# EAGLE design Transceiver Module Dev Board（without MCU）_V0.1 (EAGLE 9.6.2)
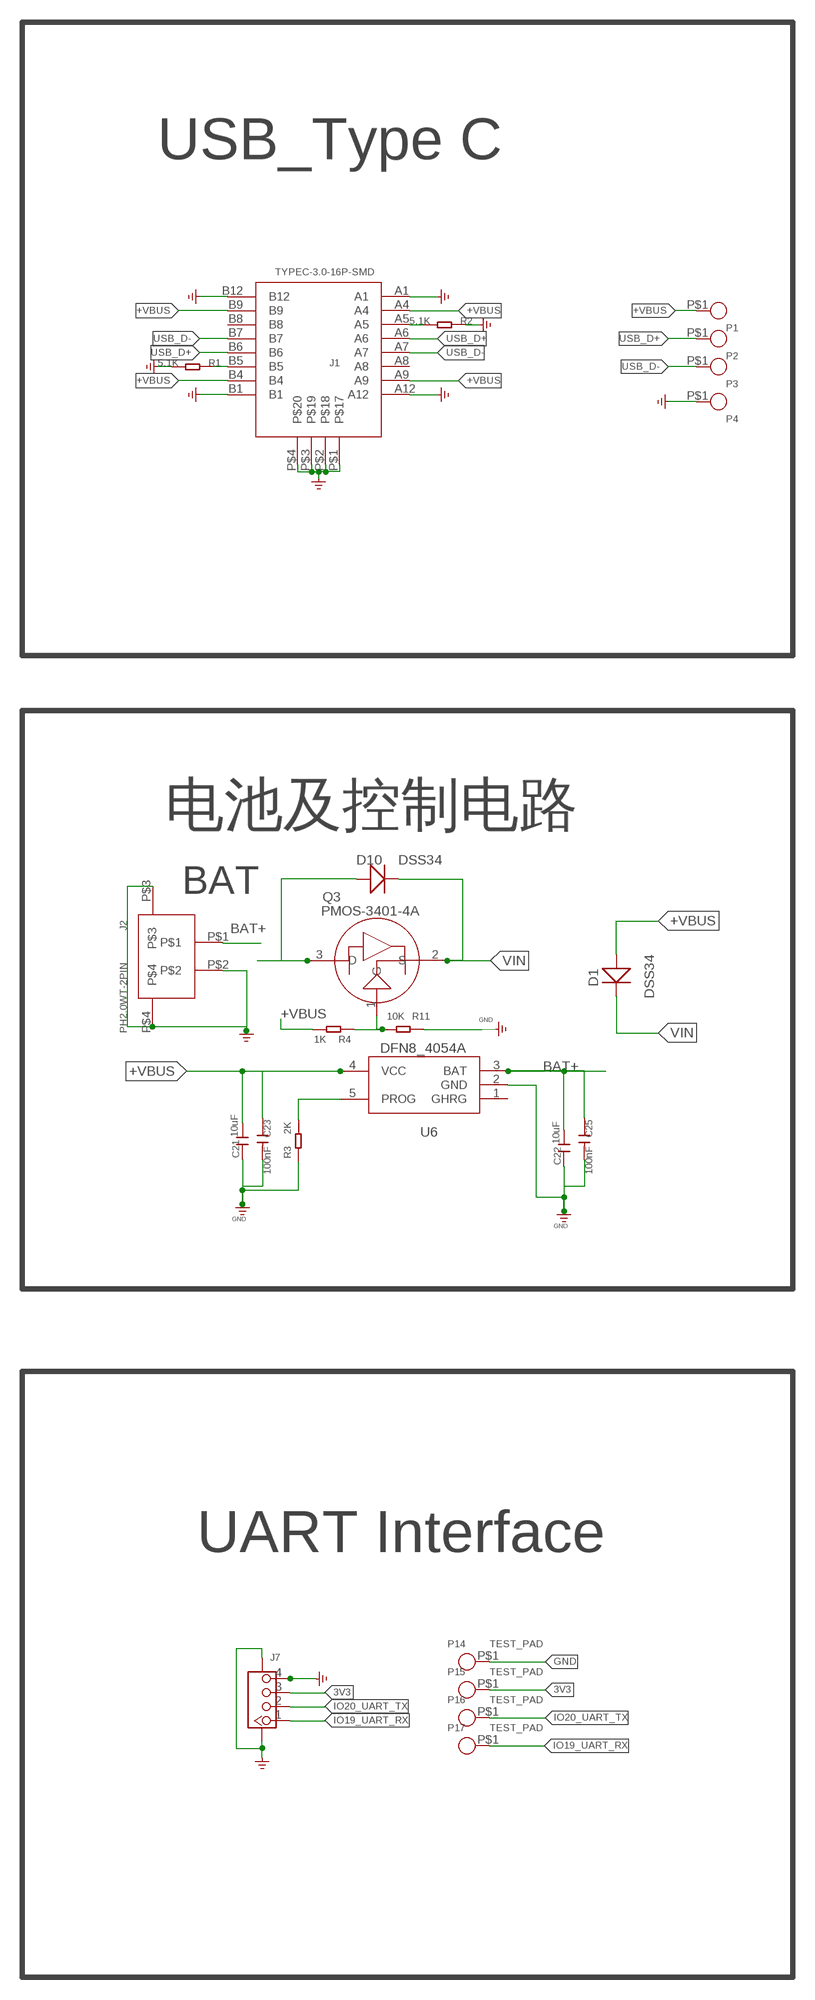
[diagram p0: schematic, sheet 1, part 1 of 2]
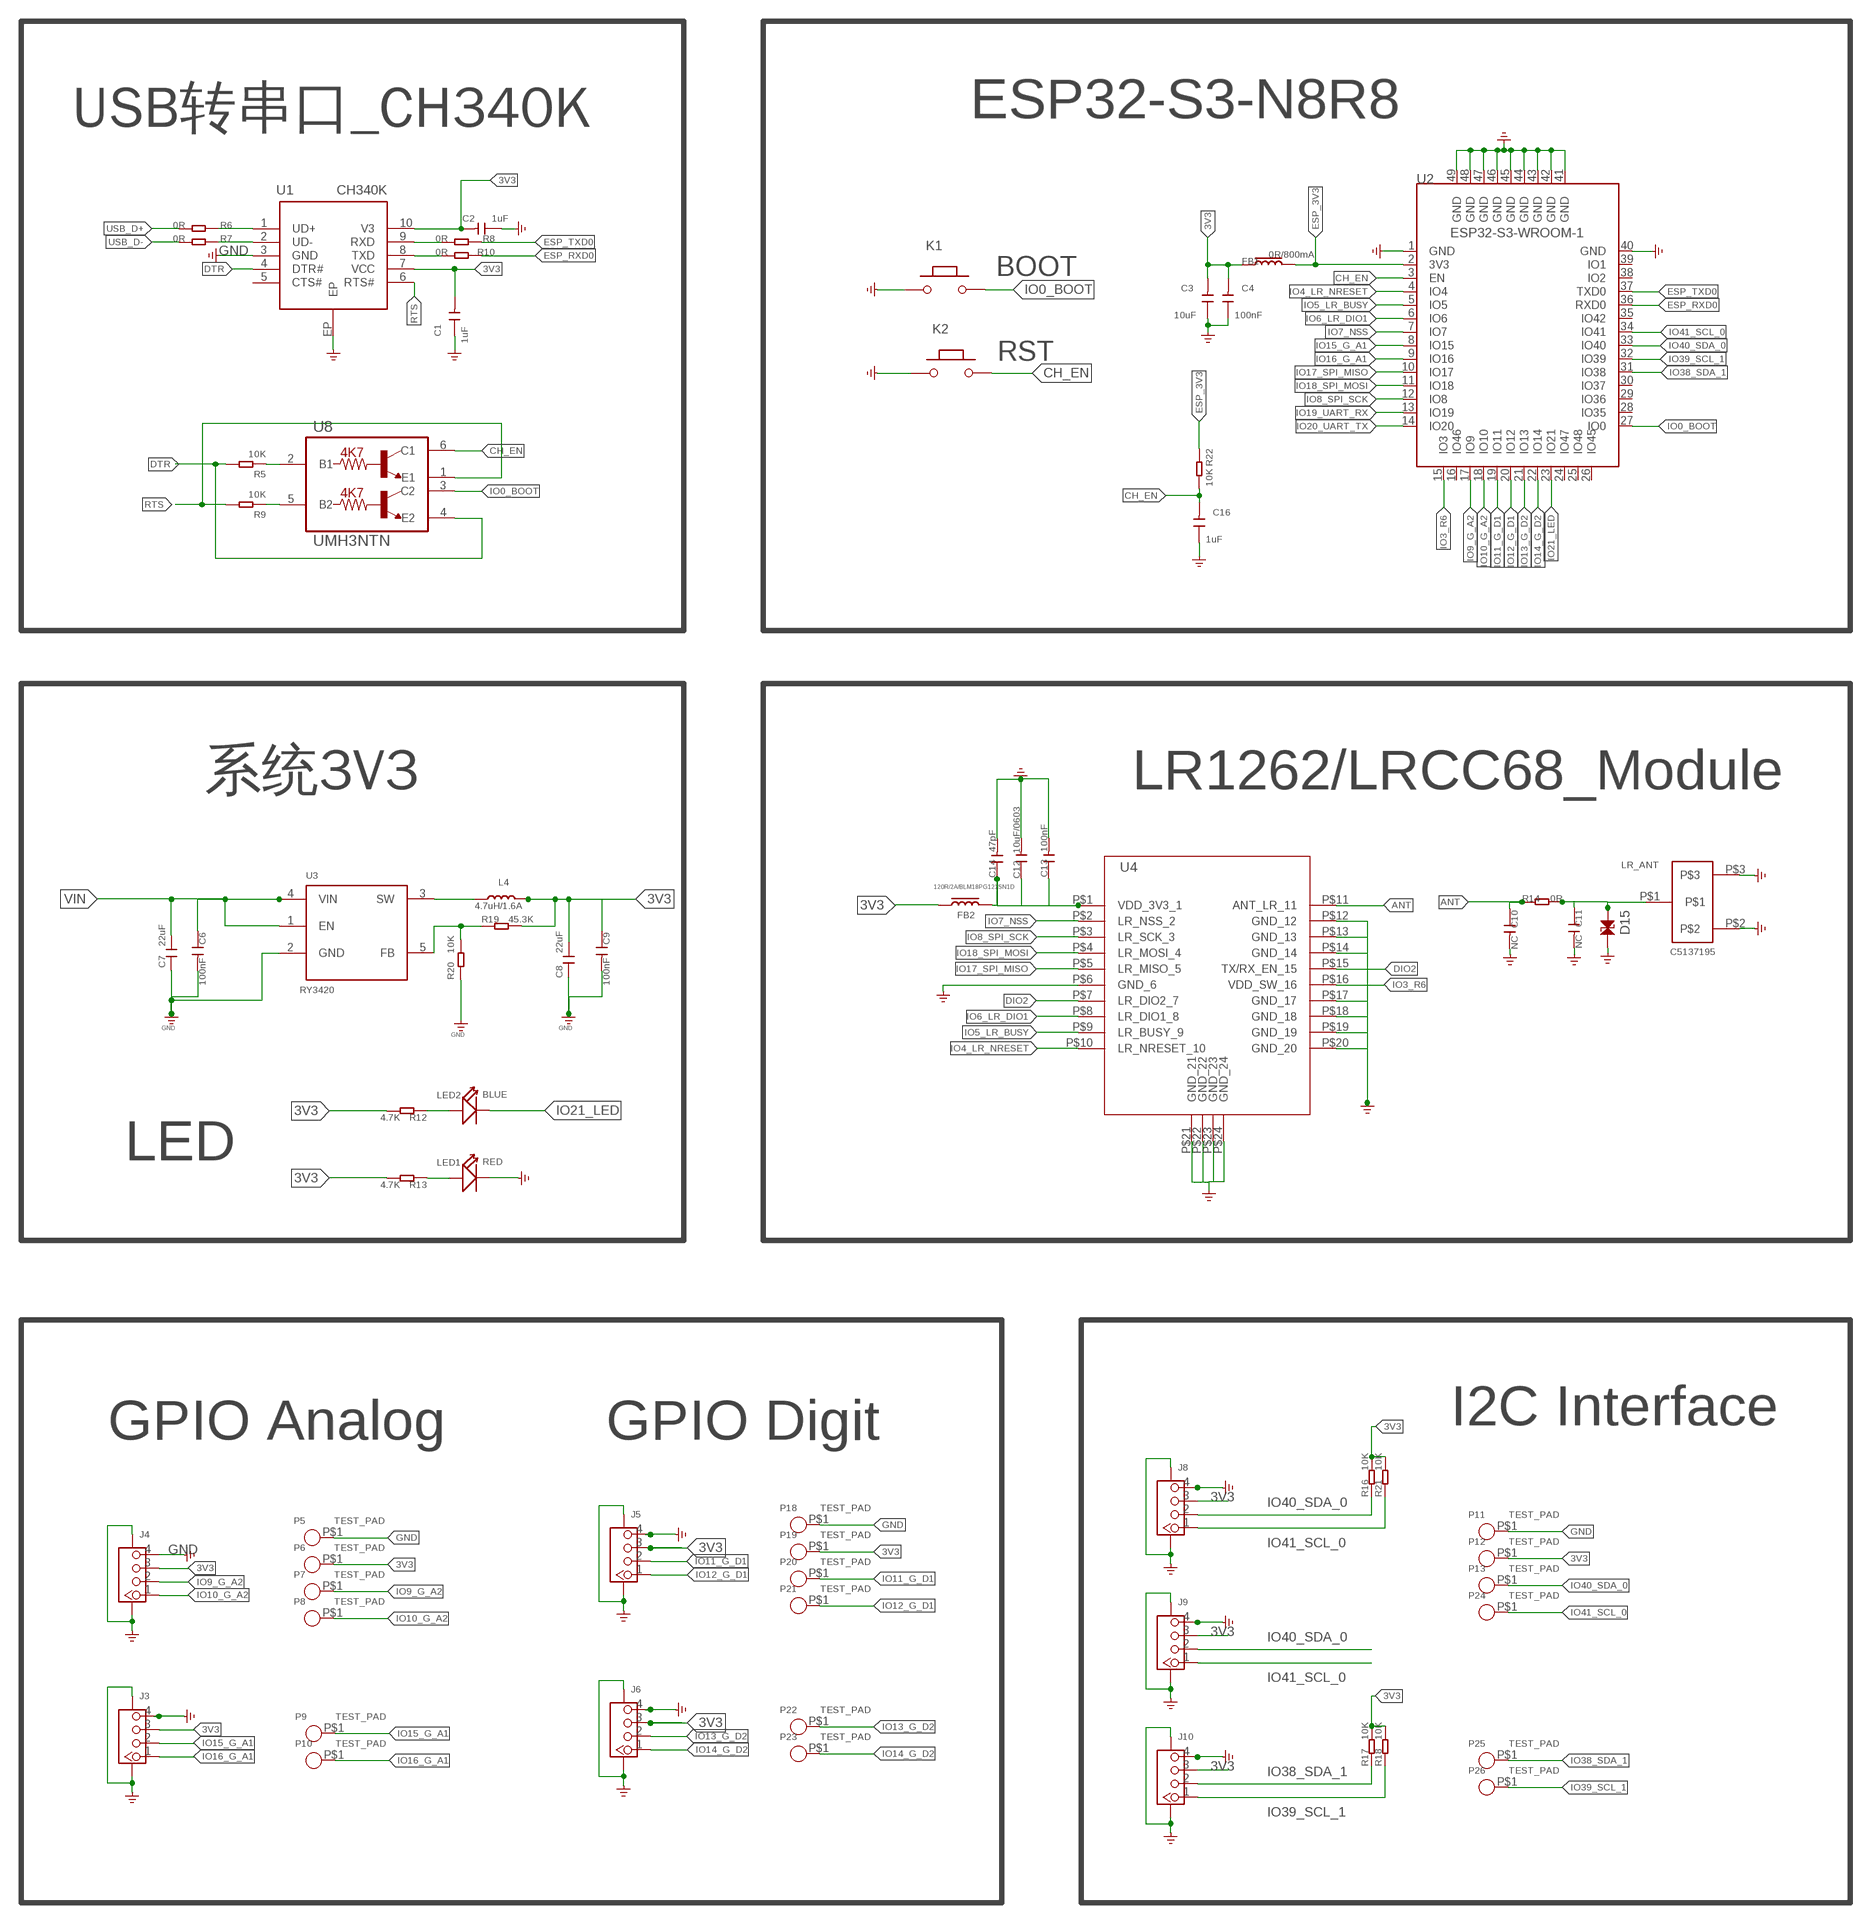
[diagram p1: schematic, sheet 1, part 2 of 2]

## Parts
C1  1uF  CAP  [C0603]
C2  1uF  CAP  [C0603]
C3  10uF  CAP  [C0603]
C4  100nF  CAP  [C0603]
C6  100nF  CAPC0402-1  [C0402]
C7  22uF  C0603  [0603]
C8  22uF  C0603  [0603]
C9  100nF  CAPC0402-1  [C0402]
C10  NC  CAPC0402-1  [C0402]
C11  NC  CAPC0402-1  [C0402]
C12  10uF/0603  C0603  [C0603]
C13  100nF  CAPC0402-1  [C0402]
C14  47pF  CAPC0402-1  [C0402]
C16  1uF  CAP  [C0603]
C21  10uF  C0402_W  [0402]
C22  10uF  C0402_W  [0402]
C23  100nF  CAPC0402-1  [C0402]
C25  100nF  CAPC0402-1  [C0402]
D1  DSS34  DIODE  [D_SOD123FL]
D10  DSS34  DIODE  [D_SOD123FL]
D15  LXES15AAA1-153  [0402-ESD]
FB1  0R/800mA  FBL0603  [L0603]
FB2  120R/2A/BLM18PG121SN1D  FBL0603  [L0603]
J1  TYPEC-3.0-16P-SMD  [USB-3.0TYPEC-SMD]
J2  PH2.0WT-2PIN  [PH2.0WT-2PIN]
J3  CONNECTOR_TWIG-4P-2.0-SMD-FEMALE-REINFORCE90D  [CONNECTOR_4P-SMD-2.0-90D]
J4  CONNECTOR_TWIG-4P-2.0-SMD-FEMALE-REINFORCE90D  [CONNECTOR_4P-SMD-2.0-90D]
J5  CONNECTOR_TWIG-4P-2.0-SMD-FEMALE-REINFORCE90D  [CONNECTOR_4P-SMD-2.0-90D]
J6  CONNECTOR_TWIG-4P-2.0-SMD-FEMALE-REINFORCE90D  [CONNECTOR_4P-SMD-2.0-90D]
J7  CONNECTOR_TWIG-4P-2.0-SMD-FEMALE-REINFORCE90D  [CONNECTOR_4P-SMD-2.0-90D]
J8  CONNECTOR_TWIG-4P-2.0-SMD-FEMALE-REINFORCE90D  [CONNECTOR_4P-SMD-2.0-90D]
J9  CONNECTOR_TWIG-4P-2.0-SMD-FEMALE-REINFORCE90D  [CONNECTOR_4P-SMD-2.0-90D]
J10  CONNECTOR_TWIG-4P-2.0-SMD-FEMALE-REINFORCE90D  [CONNECTOR_4P-SMD-2.0-90D]
K1  BUTTON  PB157  [157SW]
K2  BUTTON  PB157  [157SW]
L4  4.7uH/1.6A  A9G_DISCRETE_L0805  [A9G_DISCRETE_L0805]
LED1  RED  DISCRETE_LED0603  [DISCRETE_LED-0603]
LED2  BLUE  DISCRETE_LED0603  [DISCRETE_LED-0603]
LR_ANT  C5137195  MYSELF_IPEX  [MYSELF_IPEX1]
P1  TEST_PADPAD-1.5MM  [TEST_PAD-1.5MM]
P2  TEST_PADPAD-1.5MM  [TEST_PAD-1.5MM]
P3  TEST_PADPAD-1.5MM  [TEST_PAD-1.5MM]
P4  TEST_PADPAD-1.5MM  [TEST_PAD-1.5MM]
P5  TEST_PAD  TEST_PADPAD-1.5MM  [TEST_PAD-1.5MM]
P6  TEST_PAD  TEST_PADPAD-1.5MM  [TEST_PAD-1.5MM]
P7  TEST_PAD  TEST_PADPAD-1.5MM  [TEST_PAD-1.5MM]
P8  TEST_PAD  TEST_PADPAD-1.5MM  [TEST_PAD-1.5MM]
P9  TEST_PAD  TEST_PADPAD-1.5MM  [TEST_PAD-1.5MM]
P10  TEST_PAD  TEST_PADPAD-1.5MM  [TEST_PAD-1.5MM]
P11  TEST_PAD  TEST_PADPAD-1.5MM  [TEST_PAD-1.5MM]
P12  TEST_PAD  TEST_PADPAD-1.5MM  [TEST_PAD-1.5MM]
P13  TEST_PAD  TEST_PADPAD-1.5MM  [TEST_PAD-1.5MM]
P14  TEST_PAD  TEST_PADPAD-1.5MM  [TEST_PAD-1.5MM]
P15  TEST_PAD  TEST_PADPAD-1.5MM  [TEST_PAD-1.5MM]
P16  TEST_PAD  TEST_PADPAD-1.5MM  [TEST_PAD-1.5MM]
P17  TEST_PAD  TEST_PADPAD-1.5MM  [TEST_PAD-1.5MM]
P18  TEST_PAD  TEST_PADPAD-1.5MM  [TEST_PAD-1.5MM]
P19  TEST_PAD  TEST_PADPAD-1.5MM  [TEST_PAD-1.5MM]
P20  TEST_PAD  TEST_PADPAD-1.5MM  [TEST_PAD-1.5MM]
P21  TEST_PAD  TEST_PADPAD-1.5MM  [TEST_PAD-1.5MM]
P22  TEST_PAD  TEST_PADPAD-1.5MM  [TEST_PAD-1.5MM]
P23  TEST_PAD  TEST_PADPAD-1.5MM  [TEST_PAD-1.5MM]
P24  TEST_PAD  TEST_PADPAD-1.5MM  [TEST_PAD-1.5MM]
P25  TEST_PAD  TEST_PADPAD-1.5MM  [TEST_PAD-1.5MM]
P26  TEST_PAD  TEST_PADPAD-1.5MM  [TEST_PAD-1.5MM]
Q3  PMOS-3401-4A  P-MOS-SOT23  [SOT-23]
R1  5.1K  RES-0603  [R0603-SP]
R2  5.1K  RES-0603  [R0603-SP]
R3  2K  R0402-1  [0402]
R4  1K  R0402-1  [0402]
R5  10K  RES-0603  [R0603-SP]
R6  0R  RES-0603  [R0603-SP]
R7  0R  RES-0603  [R0603-SP]
R8  0R  RES-0603  [R0603-SP]
R9  10K  RES-0603  [R0603-SP]
R10  0R  RES-0603  [R0603-SP]
R11  10K  R0402-1  [0402]
R12  4.7K  R0402-1  [0402]
R13  4.7K  R0402-1  [0402]
R14  0R  RES-0402  [R0402]
R16  10K  R0402-1  [0402]
R17  10K  R0402-1  [0402]
R18  10K  R0402-1  [0402]
R19  45.3K  R0402-1  [0402]
R20  10K  R0402-1  [0402]
R21  10K  R0402-1  [0402]
R22  10K  RES-0603  [R0603-SP]
U1  CH340K  [ESOP-10-EP-150MIL]
U2  ESP32-S3-WROOM-1  [ESP32-S3-WROOM-1-SMD41]
U3  RY3420  CROWBOT_-V1.0-20220525_A_XBJ_HM3420B  [CROWBOT_-V1.0-20220525_A_XBJ_SOT23-5]
U4  LR1262_LRCC68_MD_1010MM  [LR1262_LRCC68_MD_10*10MM]
U6  DFN8_4054A  [DFN8_SOP23-5]
U8  UMH3NTN  [SOP65P210X100-6N]

## Nets
3V3: C1.2 C2.2 C3.2 C4.2 C8.2 C9.1 FB1.1 FB2.1 J3.3 J4.3 J5.3 J6.3 J7.3 J8.3 J9.3 J10.3 L4.2 P6.P$1 P12.P$1 P15.P$1 P19.P$1 R12.2 R13.2 R16.2 R17.2 R18.2 R19.2 R21.2 U1.7(VCC) U1.10(V3)
+VBUS: C21.2 C23.1 D1.+ J1.A4 J1.A9 J1.B4 J1.B9 P1.P$1 R4.2 U6.4(VCC)
ANT: C10.1 R14.1 U4.P$11(ANT_LR_11)
BAT+: C22.2 C25.1 D10.+ J2.P$1 Q3.3(D) U6.3(BAT)
CH_EN: C16.2 K2.2 R22.2 U2.3(EN) U8.6(C1)
DIO2: U4.P$7(LR_DIO2_7) U4.P$15(TX/RX_EN_15)
DTR: R5.2 U1.4(DTR#) U8.4(E2)
ESP_3V3: FB1.2 R22.1 U2.2(3V3)
ESP_RXD0: R10.1 U2.36(RXD0)
ESP_TXD0: R8.1 U2.37(TXD0)
GND: C1.1 C2.1 C3.1 C4.1 C6.2 C7.1 C8.1 C9.2 C10.2 C11.2 C12.2 C13.2 C14.2 C16.1 C21.1 C22.1 C23.2 C25.2 D15.1 J1.A1 J1.A12 J1.B1 J1.B12 J1.P$1 J1.P$2 J1.P$3 J1.P$4 J2.P$2 J2.P$3 J2.P$4 J3.4 J3.SS1 J3.SS2 J4.4 J4.SS1 J4.SS2 J5.4 J5.SS1 J5.SS2 J6.4 J6.SS1 J6.SS2 J7.4 J7.SS1 J7.SS2 J8.4 J8.SS1 J8.SS2 J9.4 J9.SS1 J9.SS2 J10.4 J10.SS1 J10.SS2 K1.1 K2.1 LED1.- LR_ANT.P$2 LR_ANT.P$3 P4.P$1 P5.P$1 P11.P$1 P14.P$1 P18.P$1 R1.2 R2.1 R3.1 R11.1 R20.1 U1.3(GND) U1.EP U2.1(GND) U2.40(GND) U2.41(GND) U2.42(GND) U2.43(GND) U2.44(GND) U2.45(GND) U2.46(GND) U2.47(GND) U2.48(GND) U2.49(GND) U3.2(GND) U4.P$6(GND_6) U4.P$12(GND_12) U4.P$13(GND_13) U4.P$14(GND_14) U4.P$17(GND_17) U4.P$18(GND_18) U4.P$19(GND_19) U4.P$20(GND_20) U4.P$21(GND_21) U4.P$22(GND_22) U4.P$23(GND_23) U4.P$24(GND_24) U6.2(GND)
IO0_BOOT: K1.2 U2.27(IO0) U8.3(C2)
IO3_R6: U2.15(IO3) U4.P$16(VDD_SW_16)
IO4_LR_NRESET: U2.4(IO4) U4.P$10(LR_NRESET_10)
IO5_LR_BUSY: U2.5(IO5) U4.P$9(LR_BUSY_9)
IO6_LR_DIO1: U2.6(IO6) U4.P$8(LR_DIO1_8)
IO7_NSS: U2.7(IO7) U4.P$2(LR_NSS_2)
IO8_SPI_SCK: U2.12(IO8) U4.P$3(LR_SCK_3)
IO9_G_A2: J4.2 P7.P$1 U2.17(IO9)
IO10_G_A2: J4.1 P8.P$1 U2.18(IO10)
IO11_G_D1: J5.2 P20.P$1 U2.19(IO11)
IO12_G_D1: J5.1 P21.P$1 U2.20(IO12)
IO13_G_D2: J6.2 P22.P$1 U2.21(IO13)
IO14_G_D2: J6.1 P23.P$1 U2.22(IO14)
IO15_G_A1: J3.2 P9.P$1 U2.8(IO15)
IO16_G_A1: J3.1 P10.P$1 U2.9(IO16)
IO17_SPI_MISO: U2.10(IO17) U4.P$5(LR_MISO_5)
IO18_SPI_MOSI: U2.11(IO18) U4.P$4(LR_MOSI_4)
IO19_UART_RX: J7.1 P17.P$1 U2.13(IO19)
IO20_UART_TX: J7.2 P16.P$1 U2.14(IO20)
IO21_LED: LED2.- U2.23(IO21)
IO38_SDA_1: J10.2 P25.P$1 R17.1 U2.31(IO38)
IO39_SCL_1: J10.1 P26.P$1 R18.1 U2.32(IO39)
IO40_SDA_0: J8.2 J9.2 P13.P$1 R16.1 U2.33(IO40)
IO41_SCL_0: J8.1 J9.1 P24.P$1 R21.1 U2.34(IO41)
LR_3V3: C12.1 C13.1 C14.1 FB2.2 U4.P$1(VDD_3V3_1)
N$1: J1.B5 R1.1
N$2: J1.A5 R2.2
N$3: Q3.1(G) R4.1 R11.2
N$5: R6.1 U1.1(UD+)
N$6: R7.1 U1.2(UD-)
N$7: R5.1 U8.2(B1)
N$8: R9.1 U8.5(B2)
N$10: R8.2 U1.9(RXD)
N$11: R10.2 U1.8(TXD)
N$12: LED2.+ R12.1
N$13: L4.1 U3.3(SW)
N$15: LED1.+ R13.1
N$17: C11.1 D15.2 LR_ANT.P$1 R14.2
N$20: R19.1 R20.2 U3.5(FB)
N$22: R3.2 U6.5(PROG)
RTS: R9.2 U1.6(RTS#) U8.1(E1)
USB_D+: J1.A6 J1.B6 P2.P$1 R6.2
USB_D-: J1.A7 J1.B7 P3.P$1 R7.2
VIN: C6.1 C7.2 D1.- D10.- Q3.2(S) U3.1(EN) U3.4(VIN)
Unconnected: J1.A8 J1.B8 U1.5(CTS#) U2.16(IO46) U2.24(IO47) U2.25(IO48) U2.26(IO45) U2.28(IO35) U2.29(IO36) U2.30(IO37) U2.35(IO42) U2.38(IO2) U2.39(IO1) U6.1(GHRG)

## Notes on the sheet
- GPIO Analog | GPIO Digit
- USB转串口_CH340K | ESP32-S3-N8R8
- USB_Type C
- BOOT
- RST
- I2C Interface
- 电池及控制电路 | 系统3V3 | LR1262/LRCC68_Module
- BAT
- LED
- GPIO Analog | GPIO Digit | I2C Interface
- UART Interface

## Library data of the parts
C1-C4 C16 = CrowPanel_Advance_HMI:CAP*
C6 C9-C11 C13 C14 C23 C25 = SX1302_Module:CAP*
C7 C8 = WGH:C0603
C12 = Lora_Basic_Gateway_ Module:C0603
C21 C22 = WGH:C0402_W
D1 D10 = CrowPanel_Advance_HMI:DIODE*
D15 = WM1302_Raspberry_Pi _Hat:LXES15AAA1-153
FB1 = CrowPanel_Advance_HMI:FB*
FB2 = LoraWAN_Gateway_Mainboard:FB*
J1 = CrowPanel_Advance_HMI:TYPEC-3.0-16P-SMD
J2 = cooper:PH2.0WT-2PIN
J3-J10 = A_xbj:CONNECTOR_TWIG-4P-2.0-SMD-FEMALE-REINFORCE
K1 K2 = MySMD:PB157
L4 = ESP32-S3 4.2“ EINK V1.3:A9G_DISCRETE_L*
LED1 LED2 = A_xbj:DISCRETE_LED*
LR_ANT = NBIOT:MYSELF_IPEX
P1-P4 = CrowPanel_Advance_HMI:TEST_PAD*
P5-P26 = A7670X_4G_PCIE:TEST_PAD*
Q3 = DFN8:P-MOS-SOT23
R1 R2 R5-R10 R22 = CrowPanel_Advance_HMI:RES*
R3 R4 R11-R13 R16-R21 = WGH:R0402-1
R14 = LoraWAN_Gateway_Mainboard:RES*
U1 = sale:CH340K
U2 = CrowPanel_Advance_HMI:ESP32-S3-WROOM-1
U3 = CrowPanel ESP32 Display-4.3-inch-V2.1-20240314:CROWBOT_-V1.0-20220525_A_XBJ_HM3420B
U4 = LORA_LR1110_0.0:LR1262_LRCC68_MD_10*10MM
U6 = CrowPanel ESP32 Display-4.3-inch-V2.1-20240314:DFN8_4054A
U8 = UMH3NTN:UMH3NTN: Dual NPN BJT with 4.7K Base resistor Datasheet <https://fscdn.rohm.com/en/products/databook/datasheet/discrete/transistor/digital/umh3ntn-e.pdf> BUY NOW <https://www.digikey.ca/en/products/detail/rohm-semiconductor/umh3ntn/659279> Check availability <https://pricing.snapeda.com/parts/UMH3NTN/Rohm/view-part?ref=eda>; AVAILABILITY: In Stock; CHECK_PRICES: https://www.snapeda.com/parts/UMH3NTN/Rohm/view-part/?ref=eda; DESCRIPTION: Pre-Biased Bipolar Transistor (BJT) 2 NPN - Pre-Biased (Dual) 50V 100mA 250MHz 150mW Surface Mount UMT6; MF: Rohm; MP: UMH3NTN; PACKAGE: SOT-363 Rohm; PRICE: None; PURCHASE-URL: https://www.snapeda.com/api/url_track_click_mouser/?unipart_id=355768&manufacturer=Rohm&part_name=UMH3NTN&search_term=umh3n; SNAPEDA_LINK: https://www.snapeda.com/parts/UMH3NTN/Rohm/view-part/?ref=snap

## Net classes
2 GND: width 0.203 mm

## Board
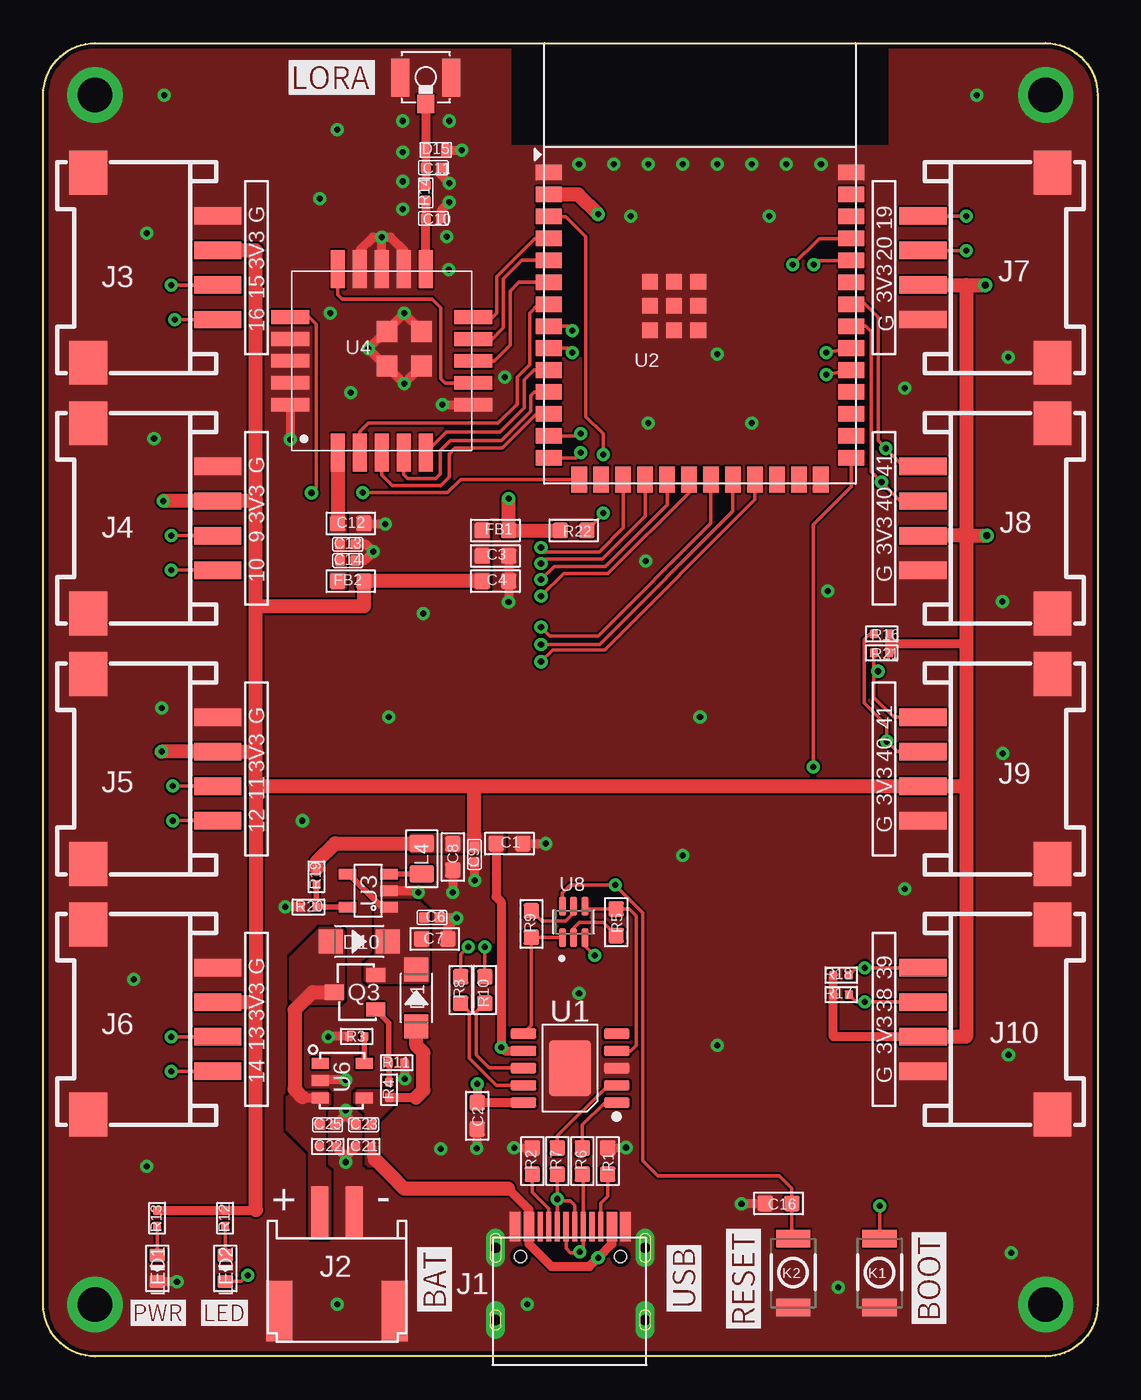
[diagram p2: board, top side]
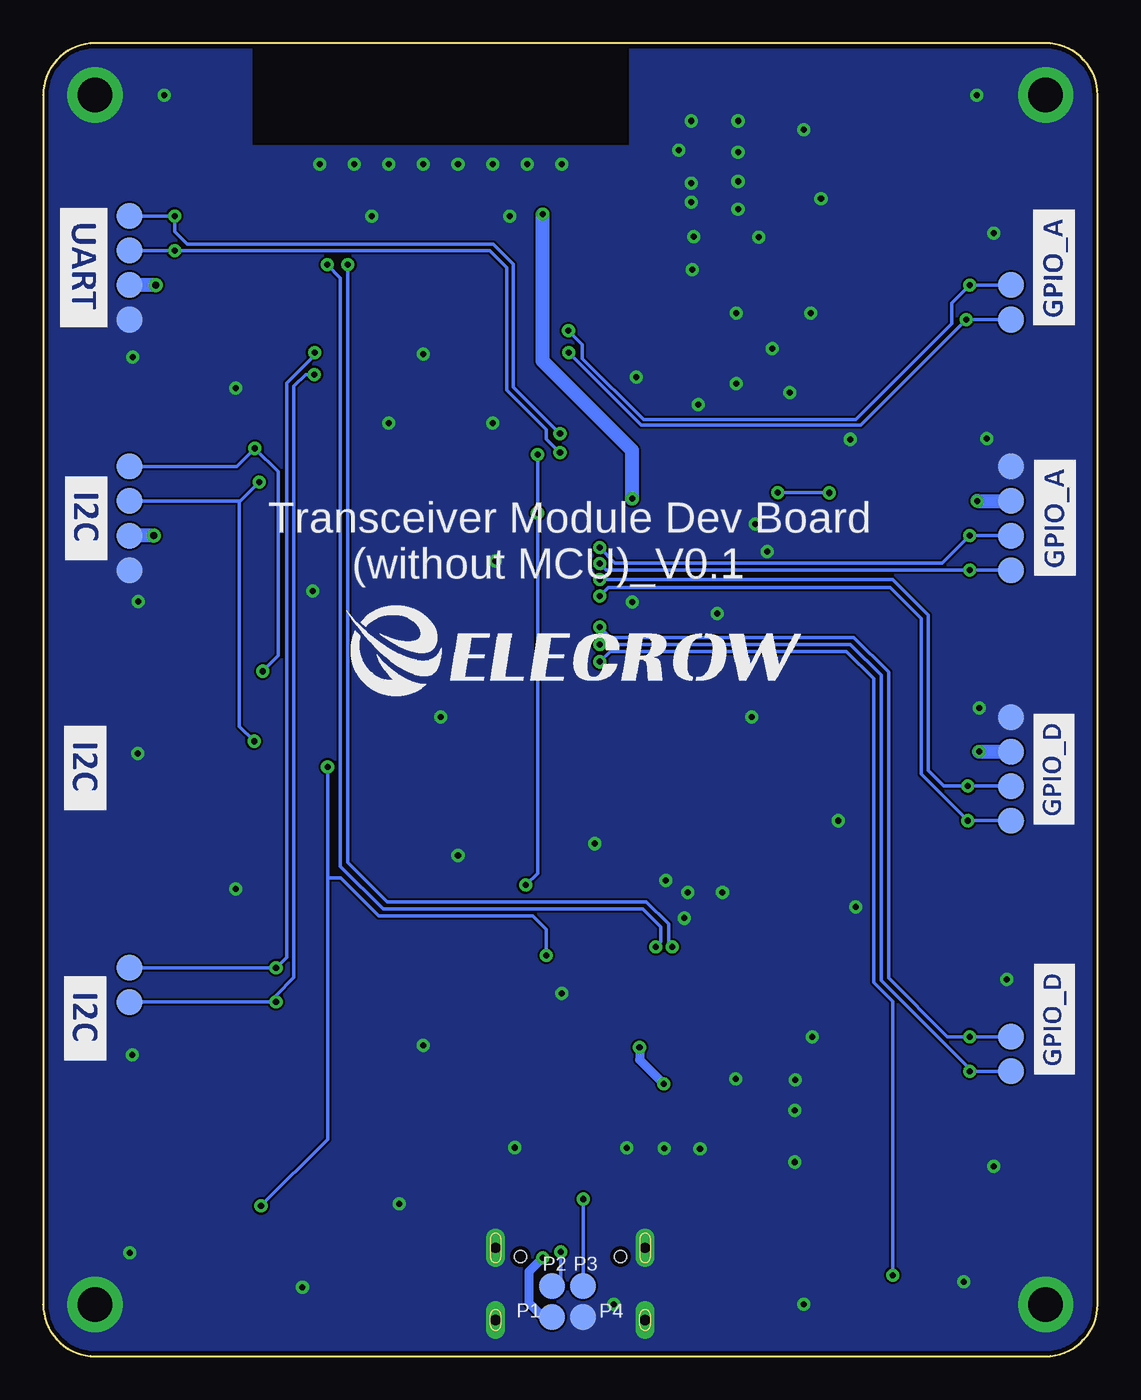
[diagram p3: board, bottom side, seen from below]

Size 61 x 76 mm. Coordinates in mm from the lower left corner, seen from the top.
Outline: 3,76 58,76 arc-90 61,73 61,3 arc-90 58,0 3,0 arc-90 0,3 0,73 arc-90 3,76
Copper layers (1*16): Top 0.035mm / dielectric 1.5mm / Bottom 0.035mm
Design rules "default": minimum track width 6mil, minimum drill 0.35mm, track to track 0.12mm, track to pad 6mil, pad to pad 6mil, via to via 6mil, smd to smd 6mil, copper to edge 10mil, drill to drill 6mil, minimum pad ring 10mil, minimum via ring 8mil, stop-mask expansion 4mil, vias tented up to drill 50mil, thermal gap 0mil

### Footprints (pad centres in the part's own frame; a part is rotated, then mirrored left to right if it is on the bottom)
C0603 = smd 0.889 x 0.889: 1 -0.762,0; 2 0.762,0
C0402 = smd 0.6 x 0.6: 1 -0.45,0; 2 0.45,0
0603 = smd 0.889 x 0.889: 1 -0.762,0; 2 0.762,0
0402 = smd 0.5 x 0.5: 1 -0.45,0; 2 0.45,0
D_SOD123FL = smd 1.397 x 1.397: + -1.651,0; - 1.651,0
0402-ESD = smd 0.5 x 0.7: 1 -0.58,0; 2 0.58,0
L0603 = smd 0.889 x 0.889: 1 -0.762,0; 2 0.762,0
USB-3.0TYPEC-SMD = smd 0.3 x 1.7: A1 -3.35,0.5; A4 -2.55,0.5; A5 -1.25,0.5; A6 -0.25,0.5; A7 0.25,0.5; A8 1.25,0.5; A9 2.55,0.5; A12 3.35,0.5; B1 3.05,0.5; B4 2.25,0.5; B5 1.75,0.5; B6 0.75,0.5; B7 -0.75,0.5; B8 -1.75,0.5; B9 -2.25,0.5; B12 -3.05,0.5 | drill 0.6 pad 1.016 long: P$1 -4.325,-0.72; P$2 4.325,-0.72; P$3 -4.325,-4.9; P$4 4.325,-4.9 | hole 0.68: -2.89,-1.22; 2.89,-1.22
PH2.0WT-2PIN = smd 1 x 3: P$1 -1,0; P$2 1,0 | smd 1.5 x 3.5: P$3 -3.35,-5.7; P$4 3.35,-5.7
CONNECTOR_4P-SMD-2.0-90D = smd 1.01 x 2.74: 1 -3,-0.1; 2 -1,-0.1; 3 1,-0.1; 4 3,-0.1 | smd 2.54 x 2.184: SS1 -5.5,7.4; SS2 5.5,7.4
157SW = smd 1.016 x 1.981: 1 0,0; 2 4,0
A9G_DISCRETE_L0805 = smd 1.016 x 1.397: 1 -0.889,0; 2 0.889,0
DISCRETE_LED-0603 = smd 0.762 x 0.889: + -0.762,0; - 0.762,0
MYSELF_IPEX1 = smd 1.05 x 1: P$1 0,0 | smd 2.2 x 1.05: P$2 1.525,-1.475; P$3 1.525,1.475
TEST_PAD-1.5MM = smd 1.5 x 1.5: P$1 0,0
SOT-23 = smd 1.1 x 0.8: 1 1.2,-1; 2 1.2,1 | smd 1.1 x 0.9: 3 -1.2,0
R0603-SP = smd 0.889 x 0.889: 1 -0.762,0; 2 0.762,0
R0402 = smd 0.635 x 0.635: 1 -0.445,0; 2 0.445,0
ESOP-10-EP-150MIL = smd 1.5 x 0.6: 1 -2.7,2; 2 -2.7,1; 3 -2.7,0; 4 -2.7,-1; 5 -2.7,-2; 6 2.7,-2; 7 2.7,-1; 8 2.7,0; 9 2.7,1; 10 2.7,2 | smd 2.4 x 3.2: EP 0,0
ESP32-S3-WROOM-1-SMD41 = smd 1.5 x 0.9: 1 -8.75,5.26; 2 -8.75,3.99; 3 -8.75,2.72; 4 -8.75,1.45; 5 -8.75,0.18; 6 -8.75,-1.09; 7 -8.75,-2.36; 8 -8.75,-3.63; 9 -8.75,-4.9; 10 -8.75,-6.17; 11 -8.75,-7.44; 12 -8.75,-8.71; 13 -8.75,-9.98; 14 -8.75,-11.25; 27 8.75,-11.25; 28 8.75,-9.98; 29 8.75,-8.71; 30 8.75,-7.44; 31 8.75,-6.17; 32 8.75,-4.9; 33 8.75,-3.63; 34 8.75,-2.36; 35 8.75,-1.09; 36 8.75,0.18; 37 8.75,1.45; 38 8.75,2.72; 39 8.75,3.99; 40 8.75,5.26 | smd 0.9 x 1.5: 15 -6.985,-12.5; 16 -5.715,-12.5; 17 -4.445,-12.5; 18 -3.175,-12.5; 19 -1.905,-12.5; 20 -0.635,-12.5; 21 0.635,-12.5; 22 1.905,-12.5; 23 3.175,-12.5; 24 4.445,-12.5; 25 5.715,-12.5; 26 6.985,-12.5 | smd 0.9 x 0.9: 41 -2.9,-1.06; 42 -1.5,-1.06; 43 -0.1,-1.06; 44 -2.9,-2.46; 45 -1.5,-2.46; 46 -0.1,-2.46; 47 -2.9,-3.86; 48 -1.5,-3.86; 49 -0.1,-3.86
CROWBOT_-V1.0-20220525_A_XBJ_SOT23-5 = smd 0.6 x 1: 1 -0.95,-1.2; 2 0,-1.2; 3 0.95,-1.2; 4 0.95,1.2; 5 -0.95,1.2
LR1262_LRCC68_MD_10*10MM = smd 2.2 x 0.8: P$1 -5.3,2.54; P$2 -5.3,1.27; P$3 -5.3,0; P$4 -5.3,-1.27; P$5 -5.3,-2.54; P$11 5.3,-2.54; P$12 5.3,-1.27; P$13 5.3,0; P$14 5.3,1.27; P$15 5.3,2.54 | smd 0.8 x 2.2: P$6 -2.54,-5.3; P$7 -1.27,-5.3; P$8 0,-5.3; P$9 1.27,-5.3; P$10 2.54,-5.3; P$16 2.54,5.3; P$17 1.27,5.3; P$18 0,5.3; P$19 -1.27,5.3; P$20 -2.54,5.3 | smd 1.2 x 1.2: P$21 -0.3,-0.3; P$22 1.7,-0.3; P$23 -0.3,-2.3; P$24 1.7,-2.3
DFN8_SOP23-5 = smd 1 x 0.635: 1 -1.27,1; 2 -1.27,0; 3 -1.27,-1; 4 1.27,-1; 5 1.27,1
SOP65P210X100-6N = smd 1.09 x 0.4: 1 -0.92,0.65; 2 -0.92,0; 3 -0.92,-0.65; 4 0.92,-0.65; 5 0.92,0; 6 0.92,0.65

### Placement (x,y rotation side)
C1  26.97,29.67 180 top
C2  25.1,13.92 90 top
C3  26.16,46.33 180 top
C4  26.16,44.86 180 top
C6  22.5,25.4 0 top
C7  22.65,24.15 180 top
C8  23.7,28.9 90 top
C9  24.95,29.05 270 top
C10  22.58,65.86 0 top
C11  22.58,68.8 0 top
C12  17.79,48.2 0 top
C13  17.62,47 0 top
C14  17.62,46.06 0 top
C16  42.55,8.85 0 top
C21  18.55,12.15 0 top
C22  16.46,12.15 180 top
C23  18.54,13.4 180 top
C25  16.45,13.4 0 top
D1  21.59,20.74 90 top
D10  18.29,24.01 0 top
D15  22.7,69.82 180 top
FB1  26.16,47.8 0 top
FB2  17.79,44.86 180 top
J1  30.5,7 0 top
J2  17,8.33 0 top
J3  10,63 90 top
J4  10,48.5 90 top
J5  10,34 90 top
J6  10,19.5 90 top
J7  51,63 270 top
J8  51,48.5 270 top
J9  51,34 270 top
J10  51,19.5 270 top
K1  48.39,2.82 90 top
K2  43.39,2.82 90 top
L4  21.9,28.8 90 top
LED1  6.6,5.09 270 top
LED2  10.54,5.09 270 top
LR_ANT  22.13,72.48 90 top
P1  31.56,2.26 0 bottom
P2  31.55,4.07 0 bottom
P3  29.76,4.07 0 bottom
P4  29.77,2.27 0 bottom
P5  5,51.5 0 bottom
P6  5,49.5 0 bottom
P7  5,47.5 0 bottom
P8  5,45.5 0 bottom
P9  5,62 0 bottom
P10  5,60 0 bottom
P11  56,45.5 0 bottom
P12  56,47.5 0 bottom
P13  56,49.5 0 bottom
P14  56,60 0 bottom
P15  56,62 0 bottom
P16  56,64 0 bottom
P17  56,66 0 bottom
P18  5,37 0 bottom
P19  5,35 0 bottom
P20  5,33 0 bottom
P21  5,31 0 bottom
P22  5,18.5 0 bottom
P23  5,16.5 0 bottom
P24  56,51.5 0 bottom
P25  56,20.5 0 bottom
P26  56,22.5 0 bottom
Q3  18.03,21.07 0 top
R1  32.65,11.3 90 top
R2  28.3,11.3 270 top
R3  18.13,18.51 0 top
R4  20.01,15.43 270 top
R5  33.15,25.12 90 top
R6  31.2,11.3 270 top
R7  29.75,11.3 270 top
R8  24.15,21.2 270 top
R9  28.25,25.02 270 top
R10  25.55,21.2 270 top
R11  20.45,16.99 180 top
R12  10.53,7.99 90 top
R13  6.59,7.99 90 top
R14  22.13,67.33 90 top
R16  48.51,41.81 0 top
R17  46.17,20.94 180 top
R18  46.17,22.06 180 top
R19  15.8,27.75 90 top
R20  15.35,26 0 top
R21  48.51,40.71 0 top
R22  30.69,47.8 0 top
U1  30.48,16.68 180 top
U2  38,63.25 0 top
U3  18.8,26.95 90 top
U4  19.59,57.61 90 top
U6  17.3,15.96 0 top
U8  30.69,25.14 90 top

### Tracks (layer width: path | path; a pad name or v marks a point on that pad's centre or on a via)
3V3  (via drill 0.35, 0.4)
  Top 0.508: R16.2 48.96,41.2 | 48.96,41.2 R21.2 | 48.96,41.2 49.02,41.26 53.36,41.26 53.4,41.3 | J10.3 45.72,18.5 R17.2 R18.2 | U1.10 C2.2 v25.1,15.77 | U1.7 26.71,17.68 v26.5,17.89 26.5,26.3 26.21,26.59 C1.2 | R13.2 R12.2 12.3,8.45
  Top 0.813: R19.2 15.8,28.6 16.89,29.69 L4.2 | C9.1 24.95,30.1 24.94,30.11 24.94,33 | J3.3 12.3,64 12.3,49.5 | 12.3,33 24.94,33 | 12.3,33 12.3,35 | 12.3,35 12.3,43.4 | 12.3,43.4 12.3,49.5 | 12.3,49.5 J4.3 v6.95,49.5 | J6.3 12.3,20.5 | 12.3,33 12.3,20.5 | 12.3,35 J5.3 v6.85,35 | 12.3,8.45 12.3,20.5 | 24.94,33 J9.3 53.4,33 | J7.3 53.4,62 | 53.4,47.5 53.4,41.3 53.4,33 | 53.4,62 53.4,47.5 | 53.4,47.5 J8.3 | 53.4,33 53.4,18.5 J10.3 | C4.2 FB2.1 18.55,43.4 12.3,43.4 | 53.4,62 v54.5,62 | 53.4,47.5 v54.6,47.5
  Bottom 0.508: v26.5,17.89 26.5,17.17 v25.1,15.77
  Bottom 0.813: v54.5,62 P15.P$1 | v54.6,47.5 P12.P$1 | v6.95,49.5 P6.P$1 | v6.85,35 P19.P$1
  pour Top (no thermals): 25.1,48.3 25.7,48.3 25.8,48.2 25.8,48.1 25.8,44.6 25.8,44.5 25.7,44.4 25,44.4 24.9,44.5 24.9,48.2 25,48.3
  pour Top (no thermals): 21.3,30.2 26.6,30.2 26.7,30.1 26.7,29.3 26.6,29.2 21.3,29.2 21.2,29.3 21.2,30.1
+VBUS  (via drill 0.35)
  Top 0.152: 28.1,7.35 J1.B9 J1.A4 28.1,7.65 28.1,8.2
  Top 0.2: 28.1,7.35 28.1,6.8 | 32.9,6.6 32.9,7.35 J1.A9
  Top 0.203: J1.A9 J1.B4
  Top 0.508: 28.1,6.8 28.1,6.5 29.4,5.2 31.6,5.2 v32.1,5.7 32.9,6.5 32.9,6.6 | 28.1,8.2 28.1,8.5 26.9,9.7 | R4.2 21.58,14.98 | C21.2 19,11.6 19.21,11.39
  Top 0.813: 26.9,9.7 20.9,9.7 20.05,10.55 19.21,11.39 | 21.58,14.98 22,15.4 22,17.58 21.59,17.99 D1.+
  Bottom 0.508: v32.1,5.7 32.9,4.9 32.9,3.1 32.06,2.26 P1.P$1
  pour Top (no thermals): 18.65,11.15 18.65,14.05 18,14.7 18,15.2 18.2,15.4 20.2,15.4 20.4,15.2 20.4,14.7 19.37,13.67 19.37,11 18.8,11
ANT
  Top 0.508: R14.1 C10.1 U4.P$11
BAT+
  Top 0.508: 15,15 15.04,14.96 U6.3
  Top 0.813: Q3.3 15.57,21.07 14.54,20.04 14.54,15.46 15,15
  pour Top (no thermals): 15.6,6.8 15.4,7 15.4,11.8 14.1,13.1 14.1,15 14.4,15.3 16.4,15.3 16.6,15.1 16.6,14.6 16.3,14.3 16.3,11 16.6,10.7 16.6,7 16.4,6.8
  pour Top (no thermals): 16,24.8 17.2,24.8 17.4,24.6 17.4,24.5 17.4,20.7 17.2,20.5 17.1,20.4 14.6,20.4 14.3,20.7 14.3,21.4 14.3,23.1
CH_EN  (via drill 0.35)
  Top 0.203: U2.3 30.23,65.97 31.4,64.8 31.4,54.39 32.4,53.39 v32.4,52.2 | U8.6 30.04,26.81 30.5,27.27 v33.09,27.27 34.7,25.66 34.7,11.3 35.55,10.45 42.57,10.45 43.31,9.71 C16.2 43.31,6.9 K2.2 | v32.4,48.8 32.4,48.75 R22.2
  Bottom 0.203: v32.4,52.2 v32.4,48.8 32.4,27.96 v33.09,27.27
DIO2
  Top 0.203: U4.P$7 23.26,56.34 23,56.6 23,60.7 22.5,61.2 17.3,61.2 17.05,61.45 U4.P$15
DTR
  Top 0.203: U8.4 31.52,25.88 R5.2 33.92,25.88 34.3,25.5 34.3,18 33.98,17.68 U1.4
ESP_3V3  (via drill 0.35)
  Top 0.813: v26.93,49.64 v26.92,49.63 FB1.2 R22.1 | U2.2 30.96,67.24 v32.1,66.1
  Bottom 0.813: v26.93,49.64 26.93,52.43 32.1,57.6 v32.1,66.1
ESP_RXD0  (via drill 0.35)
  Top 0.203: R10.1 v25.55,23.69 | v44.57,63.18 44.82,63.43 U2.36
  Bottom 0.203: v25.55,23.69 25.27,23.97 25.27,24.86 26.31,25.9 41.34,25.9 43.8,28.36 43.8,62.41 v44.57,63.18
ESP_TXD0  (via drill 0.35)
  Top 0.203: R8.1 24.15,23.25 v24.6,23.7 | v43.37,63.18 44.89,64.7 U2.37
  Bottom 0.203: v24.6,23.7 24.82,23.92 24.82,25.02 26.1,26.3 41.1,26.3 43.37,28.57 v43.37,63.18
GND  (via drill 0.35, 2 pad 3.2)
  Top 0.508: U4.P$14 18.32,64.01 19.09,64.78 v19.59,64.78 | U4.P$13 v19.59,64.78 | v19.59,64.78 20.09,64.78 20.86,64.01 U4.P$12 | D15.1 v24.21,69.82 v24.22,69.81 | C11.2 23.02,68.38 v23.5,67.9 | C10.2 23.03,66.33 v23.5,66.8 | U4.P$24 21.89,59.35 20.9,60.34 v20.9,60.37 19.89,59.36 U4.P$22 19.81,59.31 v18.81,58.31 19.81,57.31 U4.P$21 v20.9,56.3 20.9,56.32 U4.P$23 | v23.1,55.07 U4.P$6 | U4.P$20 v14.29,53.08 v14.3,53.07 | C3.1 C4.1 v26.92,43.66 | C12.2 19.77,48.2 v19.8,48.17 | C13.2 18.67,47 v19.1,46.57 18.59,46.06 C14.2 | C9.2 24.95,27.55 v24.97,27.53 | C8.1 v23.7,26.86 | C6.2 23.88,25.4 v23.92,25.36 23.41,24.85 C7.1 | U3.2 21.61,26.95 v21.7,26.86 | R3.1 v16.51,18.51 v16.5,18.5 | v17.5,16 16.07,16 U6.2 | R11.1 20.92,16.97 v20.92,16.07 | C25.2 17.51,14.01 v17.51,14.24 17.51,13.98 C23.2 | C22.1 17.51,11.55 v17.51,11.24 17.51,11.56 C21.1 | LED1.- v7.74,4.32 | C16.1 41.76,8.82 v40.4,8.82 | C2.1 25.08,13.14 v25.08,12.04 | v27.24,12.07 R2.1 | R1.2 33.7,12.06 v33.72,12.08 | C1.1 v29.08,29.67 | R20.1 v14,26
  other vias: 3,73 3,3 58,73 58,3 31,69 33,69 35,69 37,69 39,69 41,69 43,69 45,69 23.5,71.5 20.8,68 20.8,69.7 20.8,71.5 20.8,66.4 23.36,64.79 23.46,62.89 26.7,56.67 16.6,60.37 17.8,55.77 17,71 7,73 6,65 16,67 34,66 42,66 39,58 35,54 41,54 54,73 55.83,57.83 55.5,43.67 55.53,34.9 55.85,17.45 56,6 46,4 17,3 6,11 5.25,21.83 23,12 31,21 37,29 39,18 38,37 20,37 15,31 22,43 34.85,46.04 49.85,56.04 49.85,27.04 45.4,44.29 6.41,53.11 6.85,37.53 28,3
  pour Top (rank 6, no thermals): 0,76 27,76 27,70 49,70 49,76 61,76 61,72 61,0 58,0 0,0
  pour Bottom (rank 6, no thermals): 0,76 27,76 27,70 29,70 49,70 49,76 61,76 61,0 0,0
IO0_BOOT  (via drill 0.35)
  Top 0.203: U2.27 46.75,50.35 44.55,48.15 v44.55,34.12 | v48.4,8.7 48.4,6.83 K1.2 | U8.3 31.34,23.76 v31.9,23.2
  Bottom 0.203: v44.55,34.12 44.55,27.7 | 44.55,27.7 44.55,12.55 v48.4,8.7 | v31.9,23.2 31.9,24.7 32.68,25.48 41.57,25.48 43.8,27.7 44.55,27.7
IO3_R6  (via drill 0.35)
  Top 0.203: U4.P$16 15.39,60.15 15.8,59.74 15.8,50.25 v15.52,49.98 | v18.49,49.98 23.38,49.98 24.15,50.75 U2.15
  Bottom 0.203: v15.52,49.98 v18.49,49.98
IO4_LR_NRESET
  Top 0.203: U4.P$10 26.02,60.15 26.25,60.38 26.25,62.5 28.45,64.7 U2.4
IO5_LR_BUSY
  Top 0.203: U4.P$9 25.98,58.88 26.63,59.53 26.63,62.36 27.7,63.43 U2.5
IO6_LR_DIO1
  Top 0.203: U4.P$8 26.11,57.61 27.02,58.52 27.02,61.66 27.52,62.16 U2.6
IO7_NSS
  Top 0.203: U4.P$2 18.32,53.52 18.8,54 26.3,54 27.42,55.12 27.42,56.67 28.15,57.4 28.15,60.39 28.65,60.89 U2.7
IO8_SPI_SCK
  Top 0.203: U4.P$3 19.59,51.01 20.2,50.4 23,50.4 23.49,50.89 23.49,52.23 23.82,52.56 26.56,52.56 28.54,54.54 U2.12
IO9_G_A2  (via drill 0.35)
  Top 0.203: U2.17 33.55,47.95 32.16,46.56 29.04,46.56 v28.8,46.8 | v7.4,47.5 J4.2
  Bottom 0.203: v28.8,46.8 27.92,45.92 8.98,45.92 v7.4,47.5 P7.P$1
IO10_G_A2  (via drill 0.35)
  Top 0.203: U2.18 34.83,48.62 32.34,46.14 29.05,46.14 v28.8,45.89 | v7.4,45.5 J4.1
  Bottom 0.203: v28.8,45.89 28.41,45.5 7.53,45.5 v7.4,45.5 P8.P$1
IO11_G_D1  (via drill 0.35)
  Top 0.203: v28.8,44.95 29.57,45.72 32.52,45.72 36.09,49.3 U2.19 | v7.5,33 J5.2
  Bottom 0.203: v28.8,44.95 11.85,44.95 9.8,42.9 9.8,33.9 8.9,33 v7.5,33 P20.P$1
IO12_G_D1  (via drill 0.35)
  Top 0.203: U2.20 37.36,50 32.67,45.3 30.11,45.3 v28.8,43.99 | v7.5,31 J5.1
  Bottom 0.203: v28.8,43.99 28.3,44.49 11.99,44.49 10.2,42.7 10.2,33.7 v7.5,31 P21.P$1
IO13_G_D2  (via drill 0.35)
  Top 0.203: U2.21 38.64,48.23 32.1,41.7 29.3,41.7 v28.8,42.2 | v7.4,18.5 J6.2
  Bottom 0.203: v28.8,42.2 28.2,41.6 14.09,41.6 12.09,39.6 12.09,21.89 8.7,18.5 v7.4,18.5 P22.P$1
IO14_G_D2  (via drill 0.35)
  Top 0.203: U2.22 39.91,48.91 32.19,41.2 v28.8,41.2 | v7.4,16.5 J6.1
  Bottom 0.203: v28.8,41.2 14.3,41.2 12.52,39.42 12.52,21.77 7.4,16.64 v7.4,16.5 P23.P$1
IO15_G_A1  (via drill 0.35)
  Top 0.203: U2.8 30.36,59.62 v30.61,59.37 | v7.4,62 J3.2
  Bottom 0.203: v30.61,59.37 29.8,58.56 29.8,57.76 26.27,54.22 13.98,54.22 8.43,59.77 8.43,60.97 v7.4,62 P9.P$1
IO16_G_A1  (via drill 0.35)
  Top 0.203: U2.9 30.35,58.35 v30.6,58.1 | v7.6,60 J3.1
  Bottom 0.203: v30.6,58.1 26.4,53.9 13.7,53.9 v7.6,60 P10.P$1
IO17_SPI_MISO
  Top 0.203: U4.P$5 23.32,53.5 26.4,53.5 27.82,54.92 27.82,56.52 28.38,57.08 U2.10
IO18_SPI_MOSI
  Top 0.203: U4.P$4 20.86,51.04 21.1,50.8 22.7,50.8 22.97,51.07 22.97,52.42 23.55,53 26.5,53 28.2,54.7 28.2,55.6 28.41,55.81 U2.11
IO19_UART_RX  (via drill 0.35)
  Top 0.203: v53.4,66 J7.1 | v31.1,53.4 30.97,53.27 U2.13
  Bottom 0.203: v31.1,53.4 33.8,56.1 33.8,63.2 34.96,64.36 52.66,64.36 53.4,65.1 v53.4,66 P17.P$1
IO20_UART_TX  (via drill 0.35)
  Top 0.203: v31.1,52.3 30.8,52 U2.14 | v53.4,64 J7.2
  Bottom 0.203: v31.1,52.3 31.9,53.1 31.9,53.64 34.18,55.93 34.18,63.01 35.17,64 v53.4,64 P16.P$1
IO21_LED  (via drill 0.35)
  Top 0.203: LED2.- 11.47,4.33 v11.84,4.7 | U2.23 41.17,49.58 32.48,40.88 29.48,40.88 v28.8,40.2
  Bottom 0.203: v28.8,40.2 28.2,40.8 14.53,40.8 12.96,39.23 12.96,21.65 11.84,20.54 v11.84,4.7
IO38_SDA_1  (via drill 0.35)
  Top 0.203: U2.31 v45.31,56.83 | J10.2 v47.53,20.51 47.05,20.51 R17.1
  Bottom 0.203: v45.31,56.83 45.82,56.83 46.5,56.15 46.5,21.92 47.53,20.89 v47.53,20.51 P25.P$1
IO39_SCL_1  (via drill 0.35)
  Top 0.203: U2.32 v45.3,58.1 | J10.1 v47.53,22.49 47.05,22.49 R18.1
  Bottom 0.203: v45.3,58.1 45.3,57.95 46.92,56.33 46.92,23.08 47.51,22.49 v47.53,22.49 P26.P$1
IO40_SDA_0  (via drill 0.35)
  Top 0.203: U2.33 47.58,59.62 47.9,59.3 47.9,51.2 v48.5,50.6 49.6,49.5 J8.2 | R16.1 47.81,41.81 47.5,41.5 47.5,37.8 48.8,36.5 v48.8,35.6 49.4,35 J9.2
  Bottom 0.203: v48.8,35.6 49.65,36.45 49.65,49.45 v48.5,50.6 49.6,49.5 P13.P$1
IO41_SCL_0  (via drill 0.35)
  Top 0.203: U2.34 47.56,60.89 48.3,60.15 48.3,53 v48.75,52.55 49.8,51.5 J8.1 | R21.1 48.06,39.65 | 48.06,39.65 48.06,38.14 49.2,37 J9.1 | v48.3,39.65 48.06,39.65
  Bottom 0.203: v48.3,39.65 47.4,40.55 47.4,51.2 v48.75,52.55 49.8,51.5 P24.P$1
LR_3V3
  Top 0.813: U4.P$1 17.05,48.22 C12.1
  pour Top (no thermals): 16.7,48.7 17.4,48.7 17.5,48.6 17.5,44.5 17.4,44.4 16.7,44.4 16.6,44.5 16.6,45.3 16.7,45.4 16.9,45.6 16.9,47.4 16.6,47.7 16.6,48 16.6,48.6
N$1
  Top 0.203: J1.B5 32.25,8.85 32.65,9.25 R1.1
N$2
  Top 0.203: J1.A5 29.25,8.55 28.3,9.5 R2.2
N$3
  Top 0.305: R4.1 R11.2 20,19.3 Q3.1
N$5
  Top 0.203: R6.1 31.2,13.4 32.48,14.68 U1.1
N$6
  Top 0.203: R7.1 29.75,12.75 32.68,15.68 U1.2
N$7
  Top 0.203: U8.2 30.69,24.79 31,25.1 32.41,25.1 R5.1
N$8
  Top 0.203: R9.1 28.83,25.2 30.23,25.2 30.69,25.66 U8.5
N$10
  Top 0.203: U1.9 26.22,15.68 24.65,17.25 24.65,19.94 R8.2
N$11
  Top 0.203: R10.2 25.05,19.94 25.05,17.45 25.82,16.68 U1.8
N$12
  Top 0.203: R12.1 LED2.+
N$13
  Top 0.305: U3.3 20.01,27.91 L4.1
N$15
  Top 0.203: R13.1 LED1.+
N$17
  Top 0.508: LR_ANT.P$1 D15.2 C11.1 R14.2
N$20
  Top 0.305: U3.5 R20.2 R19.1
N$22
  Top 0.305: U6.5 R3.2
RTS
  Top 0.203: U8.1 30,24.26 R9.2 28.25,19.15 U1.6
USB_D+  (via drill 0.35)
  Top 0.203: J1.A6 30.25,6.25 30.5,6 31,6 v31.05,6.05 | 31.07,6.05 31.25,6.23 J1.B6 31.25,10.49
  Top 0.3: v31.05,6.05 31.07,6.05 | 31.25,10.49 R6.2
  Bottom 0.203: v31.05,6.05 31.05,4.57 P2.P$1
USB_D-  (via drill 0.35)
  Top 0.152: v29.75,9.1 29.85,9
  Top 0.203: J1.A7 30.75,8.75 30.5,9 30,9 29.85,9 | R7.2 v29.75,9.1 J1.B7
  Bottom 0.203: v29.75,9.1 P3.P$1
  Bottom 0.3: P3.P$1
VIN
  Top 0.305: U3.1 19.6,26 17.7,27.9 U3.4
  pour Top (no thermals): 19.6,26.3 21.8,26.3 22.3,25.8 22.3,21.7 22.2,21.6 18.8,21.6 18.6,21.8 18.6,22.7 19.2,23.3 19.2,25.9

### Text on the board
tPlace: 19 | G | 20 | 3V3 | 3V3 | 15 | G | 16 | 41 | G | 40 | 3V3 | 3V3 | 9 | G | 10 | 41 | G | 40 | 3V3 | 3V3 | 11 | G | 12 | 39 | G | 38 | 3V3 | 3V3 | 13 | G | 14 | + | -
bPlace: Transceiver Module Dev Board / (without MCU)_V0.1